# Altium schematic sheet fan.SchDoc
size A4; SheetNumber: 7; SheetTotal: 14
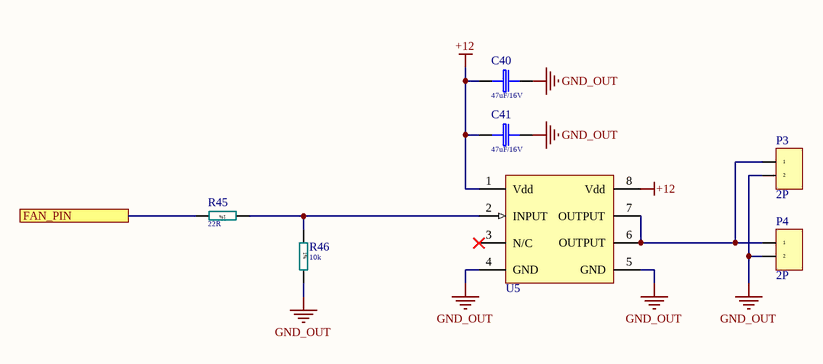
[diagram p0: fan.SchDoc]

## Parts
C40  47uF/16V  [EL Case C (6032-28)]
C41  47uF/16V  [EL Case C (6032-28)]
P3  2P  [CON: WF-02]
P4  2P  [CON: WF-02]
R45  22R  [R0603-1%]
R46  10k  [R0603-1%]
U5  TC4420  [8-SOIC]  (value not drawn)

## Ports
FAN_PIN

## Nets
+12: C40.1(+) C41.1(+) U5.1(Vdd) U5.8(Vdd)
GND_OUT: C40.2(-) C41.2(-) P3.2 P4.2 R46.2 U5.4(GND) U5.5(GND)
FAN_PIN: R45.2 ; port FAN_PIN
NetP3_1: P3.1 P4.1 U5.6(OUTPUT) U5.7(OUTPUT)
NetR45_1: R45.1 R46.1 U5.2(INPUT)

Not connected (* = marked no-connect by the designer): U5 3(N/C)*

## Notes on the sheet
- (in symbol R-0603-1%) 1%

## Library data of the parts
C40 C41 = EL Case C (6032-28): EL Tantalum Case C (6032-28); Price: 0.41; Value: 47uF/16V
R45 R46 = R-0603-1%: SMD 0603 0.0625W 1% 50V; Price: 0.017
  R45: Value: 22R
  R46: Value: 10k
P3 P4 = 2P: Value: 2P